# Altium schematic sheet CANBUS_3V3_Isolated.SchDoc: Isolated CANBUS @ 3V3
size A3; DrawnBy: Jonn Dillon; DocumentNumber: 4; Revision: 01; SheetNumber: 4; SheetTotal: 10; Version: 01; Project: Battery Managment System 2020; PageSetup: Record=PageOptions|CenterHorizontal=True|CenterVertical=True|PrintScale=0.97|XCorrection=1.00|YCorrection=1.00|PrintKind=0|BorderSize=5000000|LeftOffset=0|BottomOffset=0|Orientation=2|PaperLength=1000|PaperWidth=1000|Scale=100|PaperSource=7|PrintQuality=-4|MediaType=1|DitherType=10|PaperKind=A4|PrintScaleMode=1
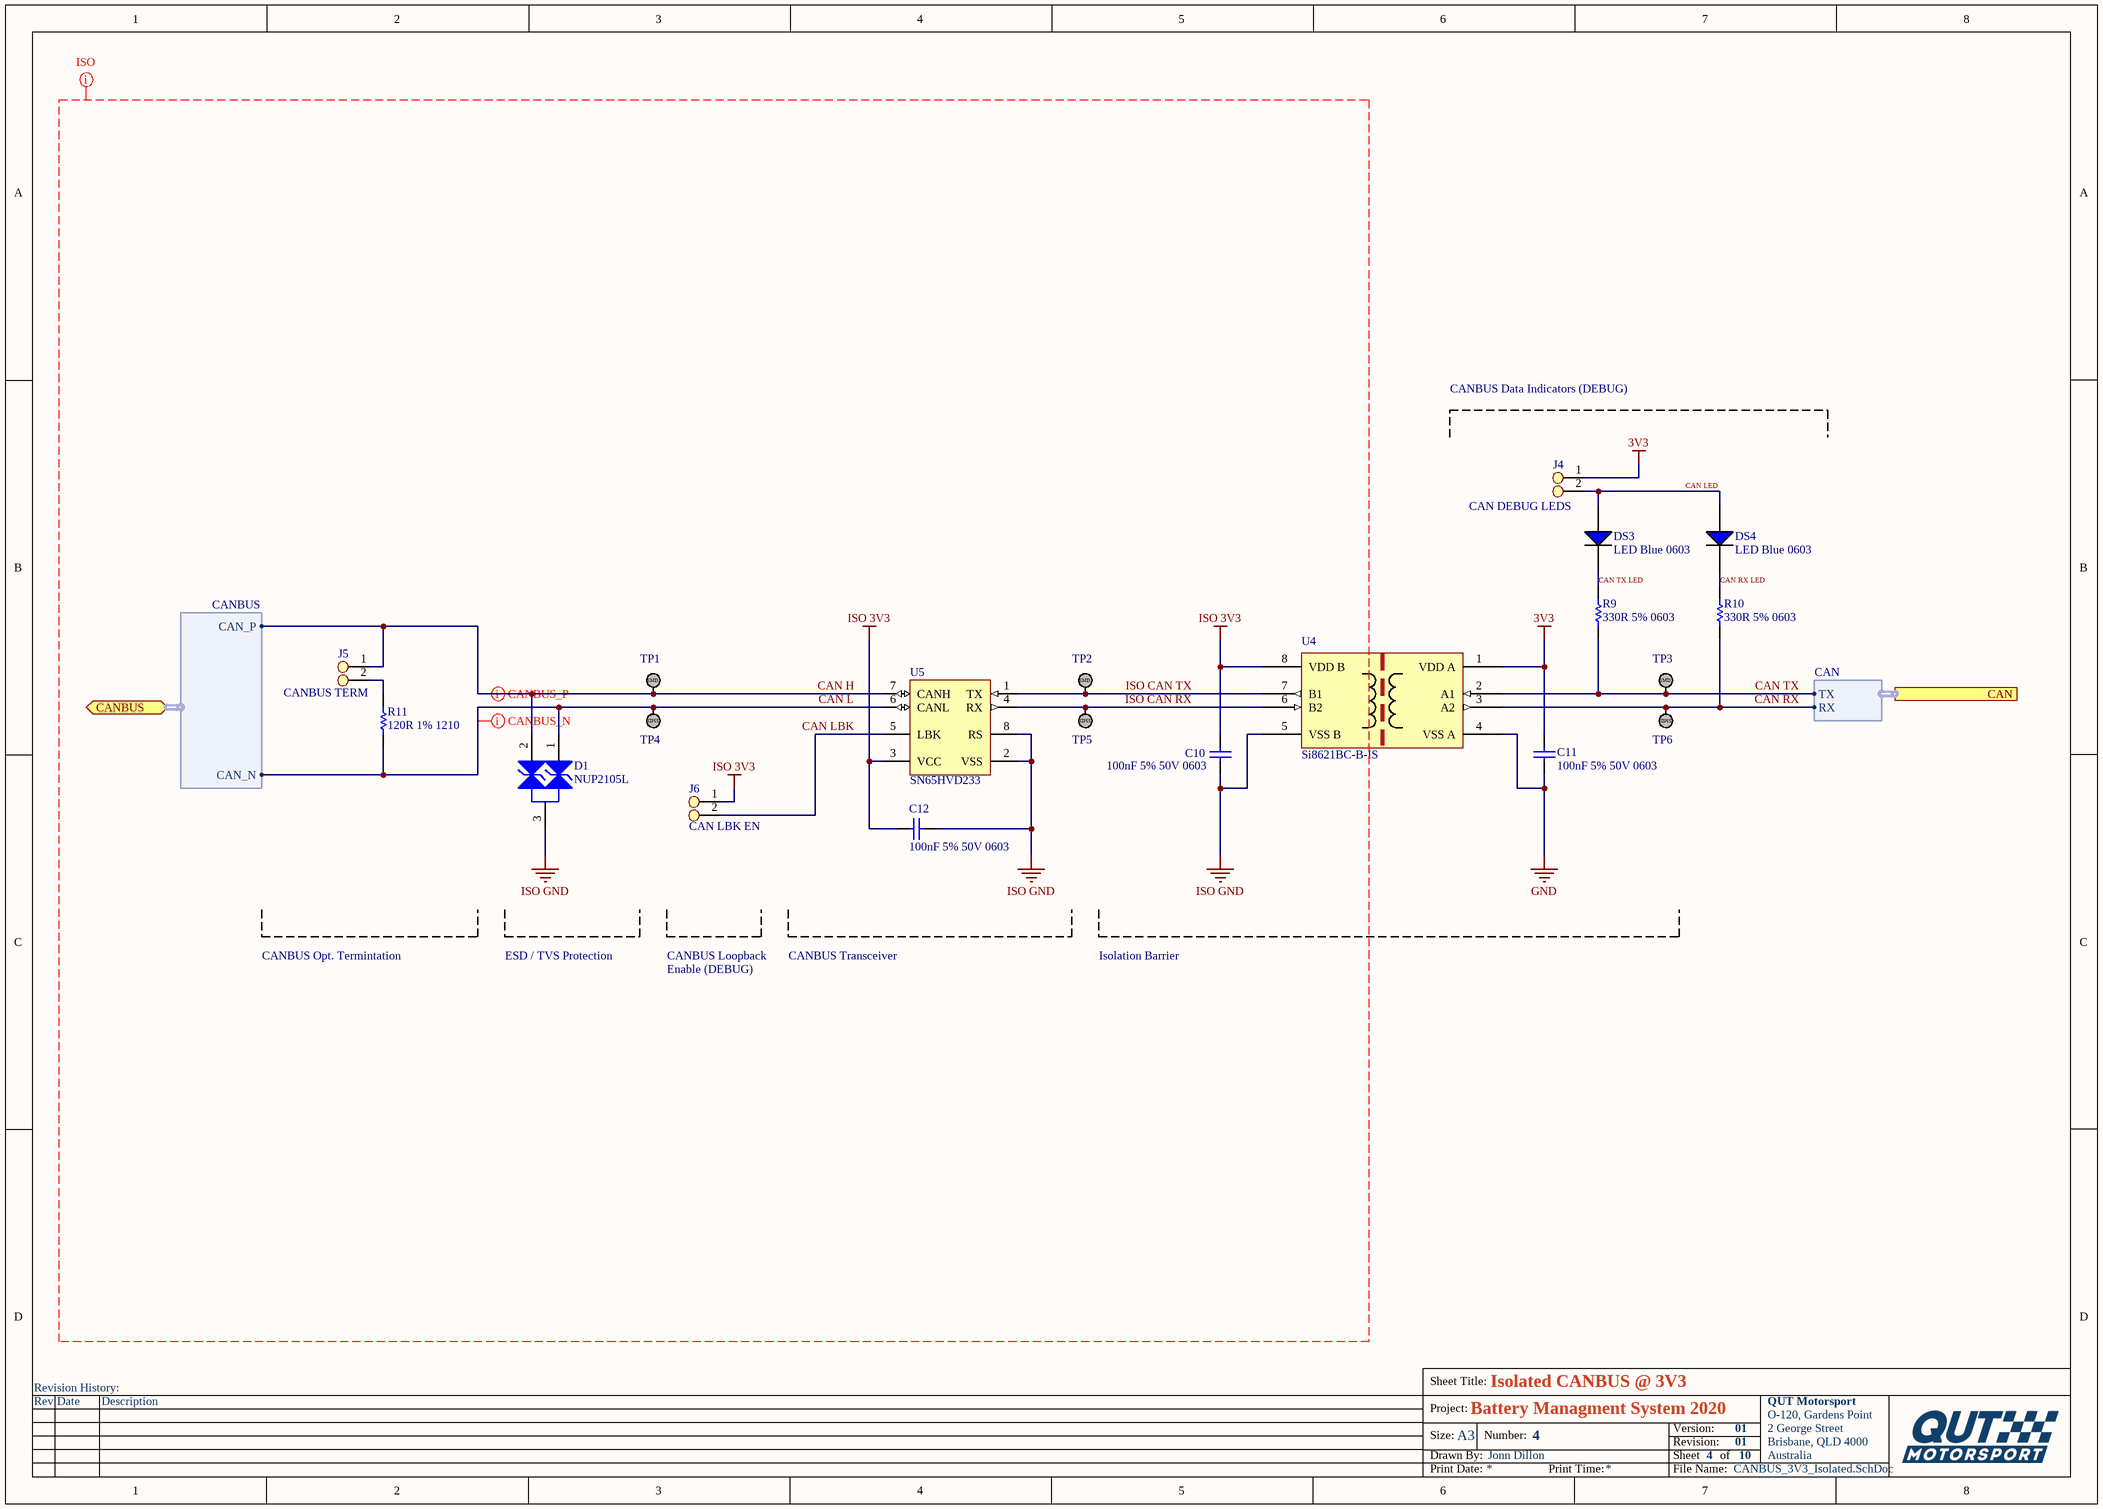
[diagram p0: CANBUS_3V3_Isolated.SchDoc]

## Parts
C10  100nF 5% 50V 0603  [CAPC1608X90X35NL15T15]
C11  100nF 5% 50V 0603  [CAPC1608X90X35NL15T15]
C12  100nF 5% 50V 0603  [CAPC1608X90X35NL15T15]
D1  NUP2105L  [NUP2105L]
DS3  LED Blue 0603  [LED BLUE 0603]
DS4  LED Blue 0603  [LED BLUE 0603]
J4  CAN DEBUG LEDS  [Jumper_2Way_Pin]
J5  CANBUS TERM  [Jumper_2Way_Pin]
J6  CAN LBK EN  [Jumper_2Way_Pin]
R9  330R 5% 0603  [RESC1608X55X25LL10T15]
R10  330R 5% 0603  [RESC1608X55X25LL10T15]
R11  120R 1% 1210  [RESC1210(3225)_M]
TP1  TestPoint_SMD  [TestPointSMD]  (value not drawn)
TP2  TestPoint_SMD  [TestPointSMD]  (value not drawn)
TP3  TestPoint_SMD  [TestPointSMD]  (value not drawn)
TP4  TestPoint_SMD  [TestPointSMD]  (value not drawn)
TP5  TestPoint_SMD  [TestPointSMD]  (value not drawn)
TP6  TestPoint_SMD  [TestPointSMD]  (value not drawn)
U4  Si8621BC-B-IS
U5  SN65HVD233  [SN65HVD233DR]

## Ports
CAN (harness CAN), CANBUS (bidir, harness CANBUS)

## Harnesses
CANBUS: CAN_P, CAN_N
CAN: RX, TX

## Nets
3V3: C11.1 J4.1 U4.1(VDD_A)
GND: C11.2 U4.4(VSS_A)
ISO 3V3: C10.1 C12.1 J6.1 U4.8(VDD_B) U5.3(VCC)
ISO GND: C10.2 C12.2 D1.3 U4.5(VSS_B) U5.2(VSS) U5.8(RS)
CAN H: D1.2 J5.1 TP1.1 U5.7(CANH) ; port CANBUS.CAN_P
CAN L: D1.1 R11.1 TP4.1 U5.6(CANL) ; port CANBUS.CAN_N
CAN LBK: J6.2 U5.5(LBK)
CAN LED: DS3.1(A) DS4.1(A) J4.2
CAN RX: R10.1 TP6.1 U4.3(A2) ; port CAN.RX
CAN RX LED: DS4.2(C) R10.2
CAN TX: R9.1 TP3.1 U4.2(A1) ; port CAN.TX
CAN TX LED: DS3.2(C) R9.2
ISO CAN RX: TP5.1 U4.6(B2) U5.4(RX)
ISO CAN TX: TP2.1 U4.7(B1) U5.1(TX)
NetJ5_2: J5.2 R11.2

## Layout directives
mark named ISO: CAN H, CAN L, CAN LBK, ISO 3V3, ISO CAN RX, ISO CAN TX, ISO GND
differential pair; differential pair class CANBUS: CAN H, CAN L

## Notes on the sheet
- CANBUS Data Indicators (DEBUG)
- CANBUS Opt. Termintation
- ESD / TVS Protection
- CANBUS Loopback
- Enable (DEBUG)
- CANBUS Transceiver
- Isolation Barrier
- Revision History:
- Sheet Title:
- Rev
- Date
- Description
- Project:
- Size:
- Drawn By:
- A3
- Number:
- Revision:
- Sheet
- Version:
- of
- QUT Motorsport
- O-120, Gardens Point
- 2 George Street
- Brisbane, QLD 4000
- Australia
- Print Date:
- Print Time:
- File Name:
- (in symbol TestPoint_SMD) SMD

## Library data of the parts
C10-C12 = CMP-2006-02049-1: Manufacturer: AVX Interconnect / Elco; Part Number: 06035C104JAT2A
J4-J6 = Jumper_2Way_Side_Pins: Jumper_2Way_Pins
R9 R10 = CMP-2000-06958-1: Chip Resistor, 330 Ohm, +/- 5%, 50 V, -55 to 155 degC, 0603 (1608 Metric), -40 to 155 degC, RoHS, Tape and Reel; Manufacturer: Yageo; Temperature Coefficient: ±100ppm/°C; Power Rating: 100mW; Voltage Rating: 50V; Product Range: RCSeries; SVHC: ToBeAdvised; Resistance: 330ohm; Resistor Element Type: ThickFilm; Resistor Case Style: 0603[1608Metric]; Manufacturer URL: http://www.yageo.com/; Packaging: CutTape; Mounting Technology: SurfaceMount; Automotive Qualification Standard: -; MSL: MSL1-Unlimited; Datasheet URL: http://www.yageo.com/documents/recent/PYu-RC_Group_51_RoHS_L_7.pdf; Package Reference: 0603; Package Description: 2-Pin Surface Mount Device, Body 1.6 x 0.8 mm; Resistance Tolerance: ±5%; Datasheet Version: Rev. 7, 05/2017
R11 = CMP-1015-00405-1: 120R 0.5W 1% 1210 (3225 Metric)  SMD; Case-Metric: 3225; Value: 120.00 Ohm; Case-EIA: 1210; Technology: SMT; Tolerance: 1 %; Power: 0.5 W
D1 = NUP2105L: ComponentLink1Description: Datasheet; ComponentLink1URL: https://www.onsemi.cn/PowerSolutions/document/NUP2105L-D.PDF; Parameter 1: *; ComponentLink2Description: LCSC; ComponentLink2URL: https://lcsc.com/product-detail/TVS_ON-Semiconductor-NUP2105LT1G_C14486.html; ComponentLink3Description: Digikey; ComponentLink3URL: https://www.digikey.com.au/product-detail/en/on-semiconductor/SZNUP2105LT1G/SZNUP2105LT1GOSCT-ND/3487669
U4 = Si8621BC-B-IS: ComponentLink1Description: Digikey; ComponentLink1URL: https://www.digikey.com.au/product-detail/en/silicon-labs/SI8621BC-B-ISR/336-4774-1-ND/8611005; ComponentLink2Description: Datasheet; ComponentLink2URL: https://www.silabs.com/documents/public/data-sheets/si861x-2x-datasheet.pdf
U5 = SN65HVD233: ComponentLink1Description: LCSC; ComponentLink1URL: https://lcsc.com/product-detail/CAN-ICs_Texas-Instruments_SN65HVD233DRG4_Texas-Instruments-Texas-Instruments-SN65HVD233DRG4_C61643.html; ComponentLink2Description: Digikey; ComponentLink2URL: https://www.digikey.com.au/product-detail/en/texas-instruments/SN65HVD233DR/296-35967-1-ND/4134960; ComponentLink3Description: Datasheet; ComponentLink3URL: https://www.ti.com/lit/ds/symlink/sn65hvd233.pdf?ts=1588560888178; ComponentLink4Description: Ti Product Page; ComponentLink4URL: https://www.ti.com/product/SN65HVD233